# Altium schematic sheet Vs1838_IR.SchDoc
size B
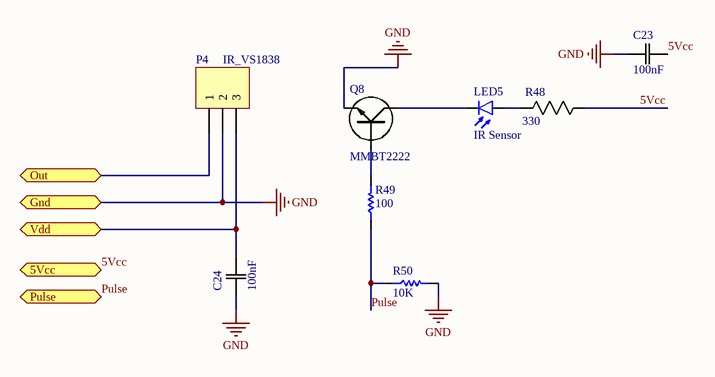
[diagram p0: Vs1838_IR.SchDoc]

## Parts
C23  100nF  [0805]
C24  100nF  [0805]
LED5  IR Sensor  [LED5mm_IR]
P4  IR_VS1838  [HDR1X3]
Q8  MMBT2222  [SOT23-BCE]
R48  330  [0805]
R49  100  [RES 0805 (2012X06L)]
R50  10K  [RES 0805 (2012X06L)]

## Ports
5Vcc (bidir), Gnd (bidir), Out (bidir), Pulse (bidir), Vdd (bidir)

## Nets
GND: C23.1(C1) C24.1(C1) P4.2 Q8.E R50.2 ; port Gnd
5Vcc: C23.2(C2) R48.1(R1) ; port 5Vcc
Out: P4.1 ; port Out
Pulse: R49.1 R50.1 ; port Pulse
Vdd: C24.2(C2) P4.3 ; port Vdd
NetLED5_1: LED5.1(A) R48.2(R2)
NetLED5_2: LED5.2(K) Q8.C
NetQ8_B: Q8.B R49.2

## Library data of the parts
C23 C24 = CAP 470nF 50V: CAP CER 0.1UF 50V X7R 0805; Value: 470nF; Tolerance: 10%; Package: 0805; Rating: 50V
LED5 = LED IR: Infra Red Reciever Photo Diode; Designer: Saeid Jorablo; Organazation: ControTec; Adding Date: 1387/12/22
P4 = Header 3: Header, 3-Pin; LatestRevisionDate: 17-Jul-2002; LatestRevisionNote: Re-released for DXP Platform.; Publisher: Altium Limited
Q8 = MMBT2222: BC847 SMALL SIGNAL NPN TRANSISTOR; Supplier 1: Digi-Key; Supplier Part Number 1: MMBT2222A-FDICT-ND
R48 = RES 330.0 1/8W - 1%: RES SMD 330 OHM 1% 1/8W 0805; Rating: 0.125W; Package: 0805; Value: 330; Tolerance: 1%
R49 R50 = Resistor: Tolerance: 5%; Power: 1/8 W
  R49: Value: 100
  R50: Value: 10K